# Altium schematic sheet BTT_toolhead_expansion.SchDoc
size A4; SheetNumber: 1; SheetTotal: 2
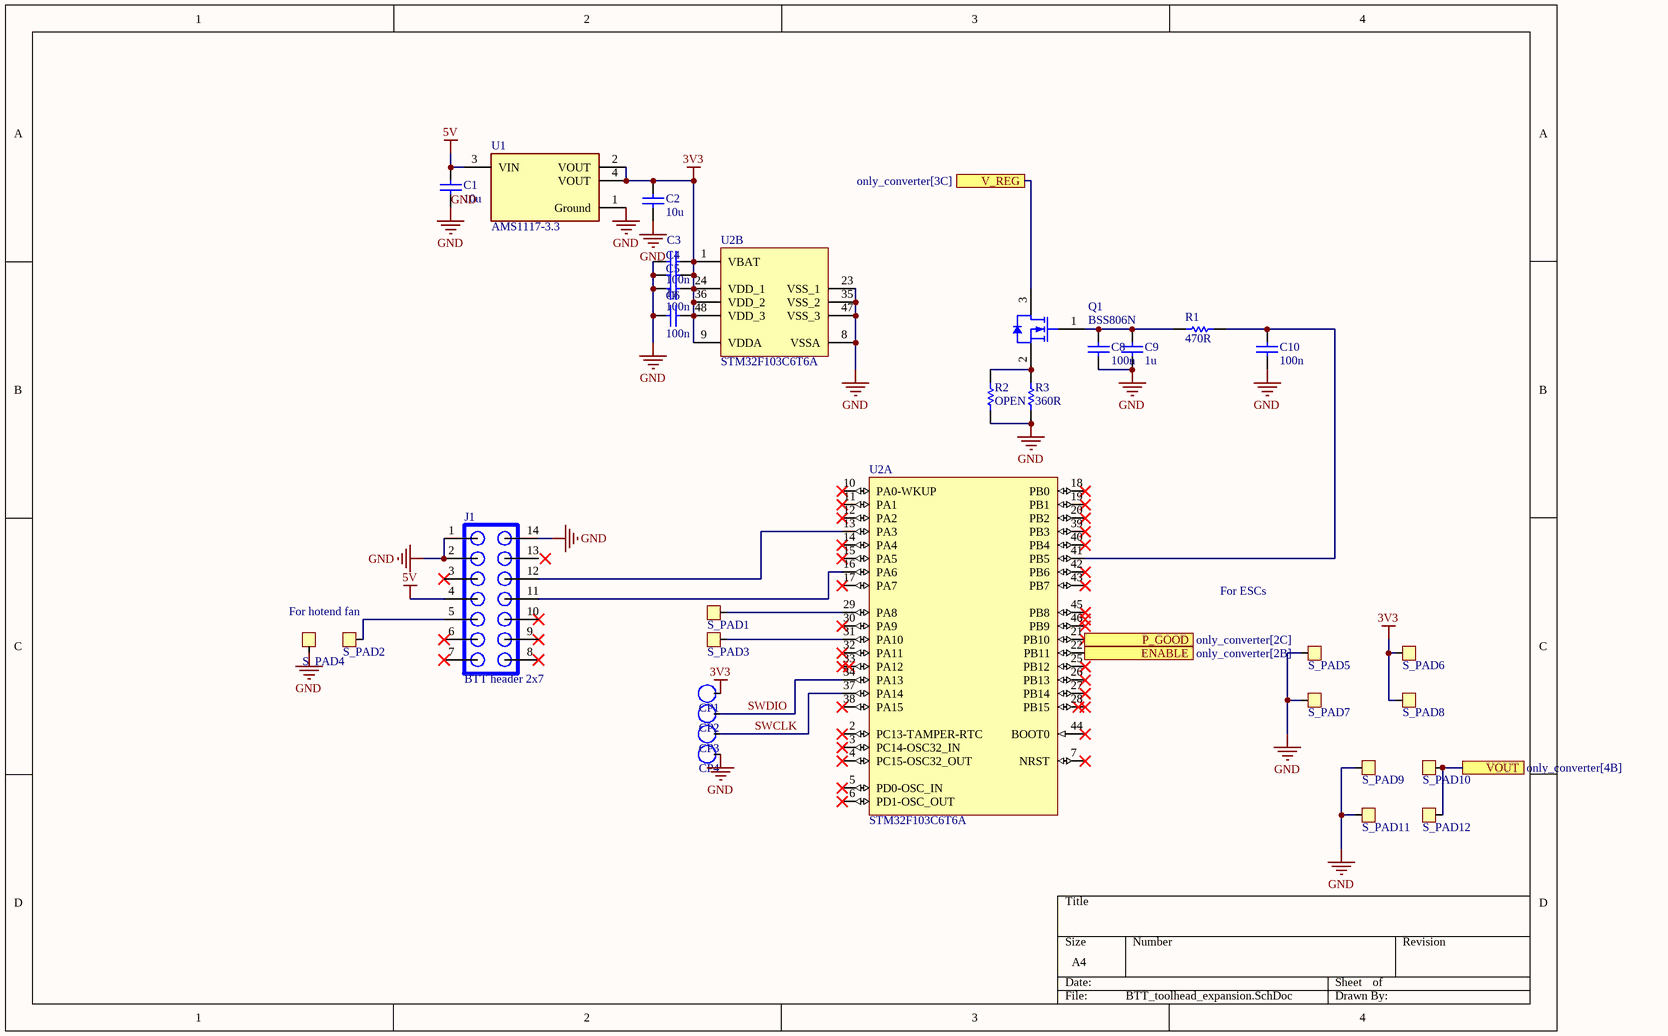
[diagram p0: BTT_toolhead_expansion.SchDoc]

## Parts
C1  value 10u  [CAP FILM 0603_1608]  (hidden comment: Capacitor)
C2  value 10u  [CAP FILM 0603_1608]  (hidden comment: Capacitor)
C3  value 100n  [CAP FILM 0603_1608]  (hidden comment: Capacitor)
C4  value 1p  [CAP FILM 0603_1608]  (hidden comment: Capacitor)
C5  value 100n  [CAP FILM 0603_1608]  (hidden comment: Capacitor)
C6  value 100n  [CAP FILM 0603_1608]  (hidden comment: Capacitor)
C8  value 100n  [CAP FILM 0603_1608]  (hidden comment: Capacitor)
C9  value 1u  [CAP FILM 0603_1608]  (hidden comment: Capacitor)
C10  value 100n  [CAP FILM 0603_1608]  (hidden comment: Capacitor)
CP1  CONNECT_PAD  [ROUND_SMALL]  (value not drawn)
CP2  CONNECT_PAD  [ROUND_SMALL]  (value not drawn)
CP3  CONNECT_PAD  [ROUND_SMALL]  (value not drawn)
CP4  CONNECT_PAD  [ROUND_SMALL]  (value not drawn)
J1  BTT header 2x7  [BTT connector 2x7 THT]
Q1  BSS806N  [INF-PG-SOT23_M]
R1  value 470R  [RES 0603_1608]  (hidden comment: Resistor)
R2  value OPEN  [RES 0603_1608]  (hidden comment: Resistor)
R3  value 360R  [RES 0603_1608]  (hidden comment: Resistor)
S_PAD1  SOLDER_PAD  [PAD_SQUARE]  (value not drawn)
S_PAD2  SOLDER_PAD  [PAD_SQUARE]  (value not drawn)
S_PAD3  SOLDER_PAD  [PAD_SQUARE]  (value not drawn)
S_PAD4  SOLDER_PAD  [PAD_SQUARE]  (value not drawn)
S_PAD5  SOLDER_PAD  [PAD_SQUARE]  (value not drawn)
S_PAD6  SOLDER_PAD  [PAD_SQUARE]  (value not drawn)
S_PAD7  SOLDER_PAD  [PAD_SQUARE]  (value not drawn)
S_PAD8  SOLDER_PAD  [PAD_SQUARE]  (value not drawn)
S_PAD9  SOLDER_PAD  [PAD_SQUARE]  (value not drawn)
S_PAD10  SOLDER_PAD  [PAD_SQUARE]  (value not drawn)
S_PAD11  SOLDER_PAD  [PAD_SQUARE]  (value not drawn)
S_PAD12  SOLDER_PAD  [PAD_SQUARE]  (value not drawn)
U1  AMS1117-3.3  [FP-AMS1117-IPC_C]
U2  STM32F103C6T6A  [STM-LQFP48_M]  (parts A,B of 2)

## Ports
ENABLE (see only_converter[2B]), P_GOOD (see only_converter[2C]), V_REG (see only_converter[3C]), VOUT (see only_converter[4B])

## Nets
3V3: C2.2 C3.1 C4.1 C5.1 C6.1 CP1.1 S_PAD6.1 S_PAD8.1 U1.2(VOUT) U1.4(VOUT) U2.1(VBAT) U2.9(VDDA) U2.24(VDD_1) U2.36(VDD_2) U2.48(VDD_3)
5V: C1.2 J1.4 U1.3(VIN)
GND: C1.1 C2.1 C3.2 C4.2 C5.2 C6.2 C8.1 C9.1 C10.1 CP4.1 J1.1 J1.2 J1.14 R2.1 R3.1 S_PAD4.1 S_PAD5.1 S_PAD7.1 S_PAD9.1 S_PAD11.1 U1.1(Ground) U2.8(VSSA) U2.23(VSS_1) U2.35(VSS_2) U2.47(VSS_3)
ENABLE: U2.22(PB11) ; port ENABLE
P_GOOD: U2.21(PB10) ; port P_GOOD
SWCLK: CP3.1 U2.37(PA14)
SWDIO: CP2.1 U2.34(PA13)
V_REG: Q1.3(DRAIN) ; port V_REG
VOUT: S_PAD10.1 S_PAD12.1 ; port VOUT
NetC8_2: C8.2 C9.2 Q1.1(GATE) R1.1
NetC10_2: C10.2 R1.2 U2.41(PB5)
NetJ1_5: J1.5 S_PAD2.1
NetJ1_11: J1.11 U2.16(PA6)
NetJ1_12: J1.12 U2.13(PA3)
NetQ1_2: Q1.2(SOURCE) R2.2 R3.2
NetS_PAD1_1: S_PAD1.1 U2.29(PA8)
NetS_PAD3_1: S_PAD3.1 U2.31(PA10)

Not connected (* = marked no-connect by the designer): J1 3* 6* 7* 8* 9* 10* 13; U2 2(PC13-TAMPER-RTC)* 3(PC14-OSC32_IN)* 4(PC15-OSC32_OUT)* 5(PD0-OSC_IN)* 6(PD1-OSC_OUT)* 7(NRST)* 10(PA0-WKUP)* 11(PA1)* 12(PA2)* 14(PA4)* 15(PA5)* 17(PA7)* 18(PB0)* 19(PB1)* 20(PB2)* 25(PB12)* 26(PB13)* 27(PB14)* 28(PB15)* 30(PA9)* 32(PA11)* 33(PA12)* 38(PA15)* 39(PB3)* 40(PB4)* 42(PB6)* 43(PB7)* 44(BOOT0)* 45(PB8)* 46(PB9)*

## Notes on the sheet
- For hotend fan
- For ESCs

## Library data of the parts
C1-C6 C8-C10 = Capacitor: SimulationGenericComponent: True
Q1 = CMP-1149-00036-1: N-Channel OptiMOS 2 Small-Signal-Transistor, 20 V VDS, 2.3 A ID, -55 to 150 degC, PG-SOT23, Reel, Green; Manufacturer: Infineon; VDS (max): 20 V; RthJA (max): 250 K/W; VGS(th) (max): 0.75Â V; QG: 1.7Â nC; RDS (on) (max) (@2.5V): 57 mOhm; VGS(th) (min): 0.3Â V; Ptot (max): 0.5Â W; Green: TRUE; IDpuls (max): 9.3Â A; ID (max): 2.3Â A; RDS (on) (max) (@1.8V): 82 mOhm; Halogen-free: TRUE; PackageVersion: Apr-08; PackageReference: PG-SOT23; PackageDescription: 3-Pin Small Outline Transistor Package, 2.9 x 1.3 mm Body, 0.95 mm Pitch; ComponentLink3URL: http://www.infineon.com/dgdl/SOT23-Package_Overview.pdf?folderId=db3a30431936bc4b0119532290053c66&fileId=db3a30431936bc4b0119533468123c85; ComponentLink3Description: Package Specification; ComponentLink2Description: Datasheet; Packing: Reel; Mounting Technology: Surface Mount; PartNumber: BSS806N; RDS (on) (max): 57 mOhm; ComponentLink2URL: http://www.infineon.com/dgdl/BSS806N_Rev2.3_.pdf?folderId=db3a3043156fd573011622e10b5c1f67&fileId=db3a304330f686060131185f0553451c; ComponentLink1URL: http://www.infineon.com/; ComponentLink1Description: Manufacturer URL; DatasheetVersion: Rev. 2.3
R1-R3 = Resistor: TC1: 0; SimulationGenericComponent: True; TC2: 0
U1 = CMP-209535-000001-1: LDO Voltage Regulators 1A, 3.3V; Manufacturer: Advanced Monolithic Systems; Dropout Voltage: 1.1V; Output Type: Fixed; Nominal Supply Current: 5mA; Max Power Dissipation: 1.2W; Max Supply Voltage: 15V; Number Of Outputs: 1; Standoff Height: 0.64mm; Max Junction Temp: +125°C; Height: 1.8mm; Package: AMS1117; Device Class L2: Power Management ICs; ComponentLink2Description: Datasheet; ComponentLink2URL: http://www.advanced-monolithic.com/pdf/ds1117.pdf; Category: IC; RoHS: TRUE; Automotive: No; Device Class L1: Integrated Circuits (ICs); Output Current: 1A; Device Class L3: Voltage Regulators - Linear; Temperature: -40°C to +125°C; Output Voltage: 3.3V; Manufacturer Part Number: AMS1117-3.3; Temperature Range Low: -40°C; Octopart: https://octopart.com/ams1117-3.3-advanced+monolithic+systems-25899300; Lead Free: Yes; Ipc Land Pattern Name: SOT229P700X180-4; Temperature Range High: +125°C
U2 = CMP-0237-00254-3: ARM Cortex-M3 32-bit MCU, 32 KB Flash, 10 KB Internal RAM, 37 I/Os, 48-pin LQFP, -40 to 85 degC, Tray; Operating Frequency(F) (Processor speed) (MHz): 72; A/D Converter: 2x12-bit (10 Channel); Supply Voltage(Vcc) min (V): 2; FLASH Size (Prog) (kB): 32; I/Os (High Current): 37; Internal RAM Size (kB): 10; PackageVersion: Rev. 6, 06/2013; ComponentLink3Description: Package Specification; ComponentLink2URL: http://www.st.com/st-web-ui/static/active/en/resource/technical/document/datasheet/CD00210843.pdf; ComponentLink1URL: http://www.st.com/web/en/home.html; PackageDescription: 48-Pin Low Profile Quad Flat Package, 7 x 7 mm Body, 0.5 mm Pitch; PartNumber: STM32F103C6T6A; ComponentLink3URL: http://www.st.com/st-web-ui/static/active/en/resource/technical/document/datasheet/DM00058181.pdf; PackageReference: LQFP48; Packing: Tray; ComponentLink2Description: Datasheet; Mounting Technology: Surface Mount; ComponentLink1Description: Manufacturer URL; Core: ARM Cortex-M3; DatasheetVersion: Rev. 6